# Altium schematic sheet KV2_MotionB8910.SchDoc
size A3; PageSetup: Record=PageOptions|CenterHorizontal=True|CenterVertical=True|PrintScale=1.00|XCorrection=1.00|YCorrection=1.00|PrintKind=2|BorderSize=5000000|LeftOffset=0|BottomOffset=0|Orientation=2|PaperLength=1000|PaperWidth=1000|Scale=100|PaperSource=7|PrintQuality=-4|MediaType=1|DitherType=10|PaperKind=A3|PrintScaleMode=1
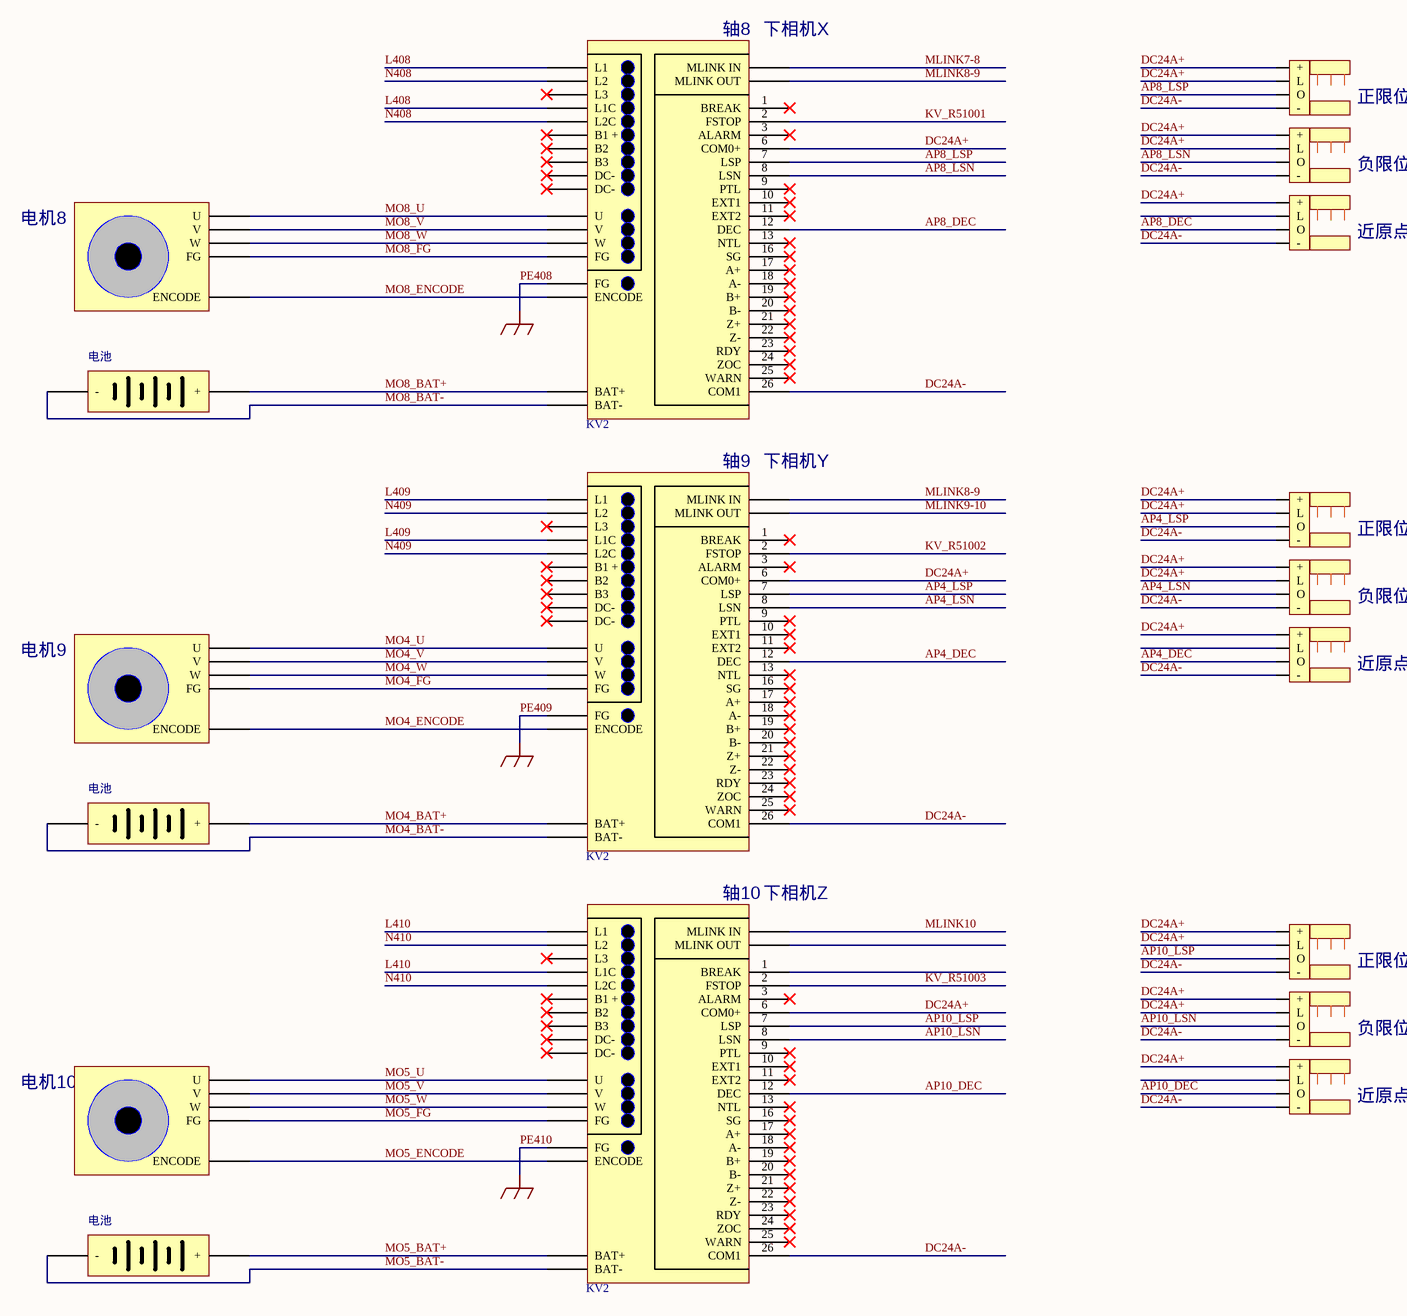
[diagram p0: KV2_MotionB8910.SchDoc]

## Parts
(Parts that share a designator on the sheet are numbered #1, #2 ... from top to bottom, then left to right.)
*#1  KV2
*#2  SV-MXXXX  (value not drawn)
*#3  电池
*#4  KV2
*#5  SV-MXXXX  (value not drawn)
*#6  电池
*#7  KV2
*#8  SV-MXXXX  (value not drawn)
*#9  电池
原点光纤传感器#1  OMRON  E3X-HD  (value not drawn)
原点光纤传感器#2  OMRON  E3X-HD  (value not drawn)
原点光纤传感器#3  OMRON  E3X-HD  (value not drawn)
原点光纤传感器#4  OMRON  E3X-HD  (value not drawn)
原点光纤传感器#5  OMRON  E3X-HD  (value not drawn)
原点光纤传感器#6  OMRON  E3X-HD  (value not drawn)
原点光纤传感器#7  OMRON  E3X-HD  (value not drawn)
原点光纤传感器#8  OMRON  E3X-HD  (value not drawn)
原点光纤传感器#9  OMRON  E3X-HD  (value not drawn)

## Nets
PE408: *#1.X43(FG) *#4.X43(FG) *#7.X43(FG)  [also labelled GND, PE409, PE410]
AP4_DEC: *#4.12(DEC) 原点光纤传感器#6.91(O)
AP4_LSN: *#4.8(LSN) 原点光纤传感器#5.91(O)
AP4_LSP: *#4.7(LSP) 原点光纤传感器#4.91(O)
AP8_DEC: *#1.12(DEC) 原点光纤传感器#3.91(O)
AP8_LSN: *#1.8(LSN) 原点光纤传感器#2.91(O)
AP8_LSP: *#1.7(LSP) 原点光纤传感器#1.91(O)
AP10_DEC: *#7.12(DEC) 原点光纤传感器#9.91(O)
AP10_LSN: *#7.8(LSN) 原点光纤传感器#8.91(O)
AP10_LSP: *#7.7(LSP) 原点光纤传感器#7.91(O)
DC24A+: *#1.6(COM0+) *#4.6(COM0+) *#7.6(COM0+) 原点光纤传感器#1.89(+) 原点光纤传感器#1.90(L) 原点光纤传感器#2.89(+) 原点光纤传感器#2.90(L) 原点光纤传感器#3.89(+) 原点光纤传感器#4.89(+) 原点光纤传感器#4.90(L) 原点光纤传感器#5.89(+) 原点光纤传感器#5.90(L) 原点光纤传感器#6.89(+) 原点光纤传感器#7.89(+) 原点光纤传感器#7.90(L) 原点光纤传感器#8.89(+) 原点光纤传感器#8.90(L) 原点光纤传感器#9.89(+)
DC24A-: *#1.26(COM1) *#4.26(COM1) *#7.26(COM1) 原点光纤传感器#1.92(-) 原点光纤传感器#2.92(-) 原点光纤传感器#3.92(-) 原点光纤传感器#4.92(-) 原点光纤传感器#5.92(-) 原点光纤传感器#6.92(-) 原点光纤传感器#7.92(-) 原点光纤传感器#8.92(-) 原点光纤传感器#9.92(-)
KV_R51001: *#1.2(FSTOP)
KV_R51002: *#4.2(FSTOP)
KV_R51003: *#7.2(FSTOP)
L408: *#1.X34(L1) *#1.X37(L1C)
L409: *#4.X34(L1) *#4.X37(L1C)
L410: *#7.X34(L1) *#7.X37(L1C)
MLINK7-8: *#1.X44(MLINK_IN)
MLINK8-9: *#1.X44(MLINK_OUT) *#4.X44(MLINK_IN)
MLINK9-10: *#4.X44(MLINK_OUT)
MLINK10: *#7.X44(MLINK_IN)
MO4_BAT+: *#4.X44(BAT+) *#6.33(+)
MO4_BAT-: *#4.X44(BAT-) *#6.32(-)
MO4_ENCODE: *#4.X44(ENCODE) *#5.29(ENCODE)
MO4_FG: *#4.X43(FG) *#5.29(FG)
MO4_U: *#4.X43(DC-) *#5.27(U)
MO4_V: *#4.X43(V) *#5.28(V)
MO4_W: *#4.X43(W) *#5.29(W)
MO5_BAT+: *#7.X44(BAT+) *#9.33(+)
MO5_BAT-: *#7.X44(BAT-) *#9.32(-)
MO5_ENCODE: *#7.X44(ENCODE) *#8.29(ENCODE)
MO5_FG: *#7.X43(FG) *#8.29(FG)
MO5_U: *#7.X43(DC-) *#8.27(U)
MO5_V: *#7.X43(V) *#8.28(V)
MO5_W: *#7.X43(W) *#8.29(W)
MO8_BAT+: *#1.X44(BAT+) *#3.33(+)
MO8_BAT-: *#1.X44(BAT-) *#3.32(-)
MO8_ENCODE: *#1.X44(ENCODE) *#2.29(ENCODE)
MO8_FG: *#1.X43(FG) *#2.29(FG)
MO8_U: *#1.X43(DC-) *#2.27(U)
MO8_V: *#1.X43(V) *#2.28(V)
MO8_W: *#1.X43(W) *#2.29(W)
N408: *#1.X35(L2) *#1.X38(L2C)
N409: *#4.X35(L2) *#4.X38(L2C)
N410: *#7.X35(L2) *#7.X38(L2C)

Not connected (* = marked no-connect by the designer): *#1 1(BREAK)* 3(ALARM)* 9(PTL)* 10(EXT1)* 11(EXT2)* 13(NTL)* 16(SG)* 17(A+)* 18(A-)* 19(B+)* 20(B-)* 21(Z+)* 22(Z-)* 23(RDY)* 24(ZOC)* 25(WARN)* X36(L3)* X39(B1_+)* X40(B2)* X41(B3)* X42(DC-)*; *#4 1(BREAK)* 3(ALARM)* 9(PTL)* 10(EXT1)* 11(EXT2)* 13(NTL)* 16(SG)* 17(A+)* 18(A-)* 19(B+)* 20(B-)* 21(Z+)* 22(Z-)* 23(RDY)* 24(ZOC)* 25(WARN)* X36(L3)* X39(B1_+)* X40(B2)* X41(B3)* X42(DC-)*; *#7 1(BREAK) 3(ALARM)* 9(PTL)* 10(EXT1)* 11(EXT2)* 13(NTL)* 16(SG)* 17(A+)* 18(A-)* 19(B+)* 20(B-)* 21(Z+)* 22(Z-)* 23(RDY)* 24(ZOC)* 25(WARN)* X36(L3)* X39(B1_+)* X40(B2)* X41(B3)* X42(DC-)*; 原点光纤传感器#3 90(L); 原点光纤传感器#6 90(L); 原点光纤传感器#9 90(L)

## Notes on the sheet
- (near *#1) 轴8
- (near *#1) 下相机X
- 正限位
- 负限位
- 电机8
- 近原点
- (near *#4) 轴9
- (near *#4) 下相机Y
- 电机9
- (near *#7) 轴10
- (near *#7) 下相机Z
- 电机10

## Library data of the parts
*#3 *#6 *#9 = BATTER
原点光纤传感器#1-原点光纤传感器#9 = OMRON_EE-SX671